# EAGLE design Adafruit 128x64 OLED FeatherWing (EAGLE 9.6.2)
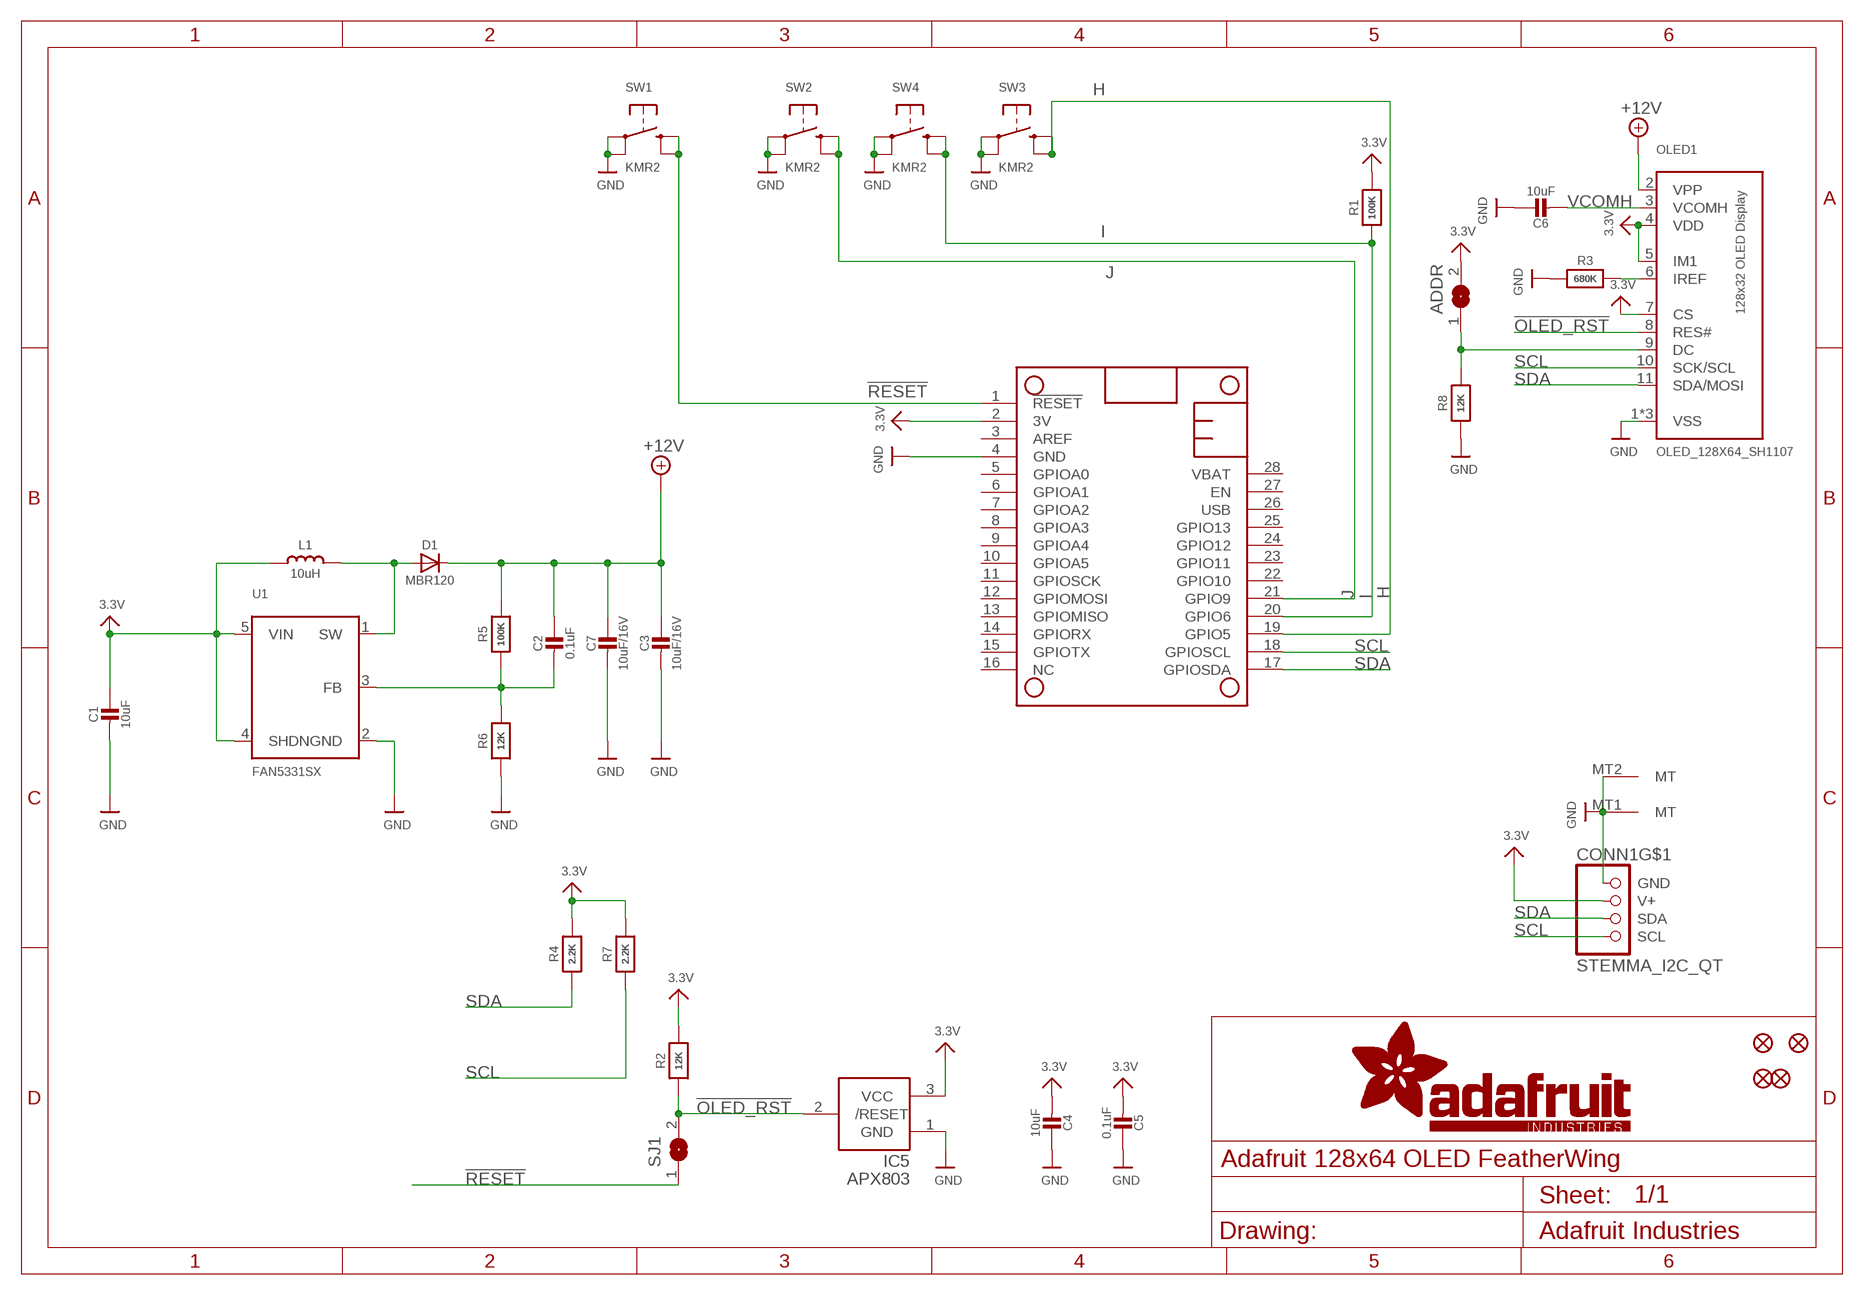
[diagram p0: schematic, sheet 1]

## Parts
ADDR  SOLDERJUMPER  [SOLDERJUMPER_ARROW_NOPASTE]
C1  10uF  CAP_CERAMIC0805-NOOUTLINE  [0805-NO]
C2  0.1uF  CAP_CERAMIC0603_NO  [0603-NO]
C3  10uF/16V  CAP_CERAMIC0805-NOOUTLINE  [0805-NO]
C4  10uF  CAP_CERAMIC0805-NOOUTLINE  [0805-NO]
C5  0.1uF  CAP_CERAMIC0603_NO  [0603-NO]
C6  10uF  CAP_CERAMIC0805-NOOUTLINE  [0805-NO]
C7  10uF/16V  CAP_CERAMIC0805-NOOUTLINE  [0805-NO]
CONN1  STEMMA_I2C_QT  [JST_SH4]
D1  MBR120  DIODESOD-123  [SOD-123]
FID1  FIDUCIAL_1MM  [FIDUCIAL_1MM]
FID2  FIDUCIAL_1MM  [FIDUCIAL_1MM]
FID3  FIDUCIAL_1MM  [FIDUCIAL_1MM]
FID4  FIDUCIAL_1MM  [FIDUCIAL_1MM]
IC5  APX803  AXP083-SAG  [SOT23]
L1  10uH  INDUCTOR  [INDUCTOR_1007]
MS1  FEATHERWING_NODIM  [FEATHERWING_NODIM]
OLED1  OLED_128X64_SH1107  [QT1107P11A]
R1  100K  RESISTOR_0603_NOOUT  [0603-NO]
R2  12K  RESISTOR_0603_NOOUT  [0603-NO]
R3  680K  RESISTOR_0603_NOOUT  [0603-NO]
R4  2.2K  RESISTOR_0603_NOOUT  [0603-NO]
R5  100K  RESISTOR_0603_NOOUT  [0603-NO]
R6  12K  RESISTOR_0603_NOOUT  [0603-NO]
R7  2.2K  RESISTOR_0603_NOOUT  [0603-NO]
R8  12K  RESISTOR_0603_NOOUT  [0603-NO]
SJ1  SOLDERJUMPERCLOSED  [SOLDERJUMPER_CLOSEDWIRE]
SW1  KMR2  SWITCH_TACT_SMT4.6X2.8  [BTN_KMR2_4.6X2.8]
SW2  KMR2  SWITCH_TACT_SMT4.6X2.8  [BTN_KMR2_4.6X2.8]
SW3  KMR2  SWITCH_TACT_SMT4.6X2.8  [BTN_KMR2_4.6X2.8]
SW4  KMR2  SWITCH_TACT_SMT4.6X2.8  [BTN_KMR2_4.6X2.8]
U1  FAN5331SX  VREG_FAN5331  [SOT23-5]

## Nets
3.3V: ADDR.2 C1.1 C4.2 C5.2 CONN1.2(V+) IC5.3(VCC) L1.P$1 MS1.2(3V) OLED1.4(VDD) OLED1.5(IM1) OLED1.7(CS) R1.2 R2.2 R4.2 R7.2 U1.4(SHDN) U1.5(VIN)
!OLED_RST: IC5.2(/RESET) OLED1.8(RES#) R2.1 SJ1.2
!RESET: MS1.1(!RESET) SJ1.1 SW1.B'(S1) SW1.B(S)
+12V: C2.1 C3.1 C7.1 D1.C OLED1.2(VPP) R5.2
GND: C1.2 C3.2 C4.1 C5.1 C6.1 C7.2 CONN1.1(GND) CONN1.MT1(MT) CONN1.MT2(MT) IC5.1(GND) MS1.4(GND) OLED1.1(VSS) OLED1.12(VSS) OLED1.13(VSS) R3.1 R6.1 R8.1 SW1.A'(P1) SW1.A(P) SW2.A'(P1) SW2.A(P) SW3.A'(P1) SW3.A(P) SW4.A'(P1) SW4.A(P) U1.2(GND)
H: MS1.19(GPIO5) SW3.B'(S1) SW3.B(S)
I: MS1.20(GPIO6) R1.1 SW4.B'(S1) SW4.B(S)
J: MS1.21(GPIO9) SW2.B'(S1) SW2.B(S)
N$1: D1.A L1.P$2 U1.1(SW)
N$2: ADDR.1 OLED1.9(DC) R8.2
N$3: C2.2 R5.1 R6.2 U1.3(FB)
N$7: OLED1.6(IREF) R3.2
SCL: CONN1.4(SCL) MS1.18(GPIOSCL) OLED1.10(SCK/SCL) R7.1
SDA: CONN1.3(SDA) MS1.17(GPIOSDA) OLED1.11(SDA/MOSI) R4.1
VCOMH: C6.2 OLED1.3(VCOMH)
Unconnected: MS1.3(AREF) MS1.5(GPIOA0) MS1.6(GPIOA1) MS1.7(GPIOA2) MS1.8(GPIOA3) MS1.9(GPIOA4) MS1.10(GPIOA5) MS1.11(GPIOSCK) MS1.12(GPIOMOSI) MS1.13(GPIOMISO) MS1.14(GPIORX) MS1.15(GPIOTX) MS1.16(NC) MS1.22(GPIO10) MS1.23(GPIO11) MS1.24(GPIO12) MS1.25(GPIO13) MS1.26(USB) MS1.27(EN) MS1.28(VBAT)

## Library data of the parts
ADDR = microbuilder:SOLDERJUMPER: SMD Solder JUMPER Solder the two pads together to create a connection, or remove the solder to break it. REFLOW - Use this footprint for solder paste and reflow ovens. WAVE - Use this footprint for hand-soldering (larger pads). CLOSED - Has a trace between the two pads to ensure it is closed by default. The trace needs to be cut to disable the jumper, and can be closed again by creating a solder bridge between the two pads.; BOM: EXCLUDE
C1-C7 = microbuilder:CAP_CERAMIC: Ceramic Capacitors For new designs, use the packages preceded by an '_' character since they are more reliable: The following footprints should be used on most boards: _0402 - Standard footprint for regular board layouts _0603 - Standard footprint for regular board layouts _0805 - Standard footprint for regular board layouts _1206 - Standard footprint for regular board layouts For extremely tight-pitch boards where space is at a premium, the following 'micro-pitch' footprints can be used (smaller pads, no silkscreen outline, etc.): _0402MP - Micro-pitch footprint for very dense/compact boards _0603MP - Micro-pitch footprint for very dense/compact boards _0805MP - Micro-pitch footprint for very dense/compact boards _1206MP - Micro-pitch footprint for very dense/compact boards
CONN1 = microbuilder:STEMMA_I2C
D1 = microbuilder:DIODE: Diode SMA Model Volts Amps Type Vf Ir Digikey # Notes SSA34-E3 40V 3A Schottky 480mV @ 3A 200uA @ 40V SSA34-E3/61TGITR-ND CDBA120-G 20V 1A Schottky 500mV @ 1A 500uA @ 20V 641-1014-6-ND REEL MBRA210 10V 2A Schottky 350mV @ 2A 700uA @ 10V MBRA210LT3 SOD-123 Model Volts Amps Type Vf Ir Order # Notes BAT54T1G 30V 200mA Schottky 800mV @ 200mA 2uA @ 25V BAT54T1GOSTR-ND B0530W 30V 500mA Schottky 430mV @ 500mA 130uA @ 30V B0530W-FDICT-ND REEL MBR120 20V 1A Schottky 340mV @ 1A MBR120VLSFT1GOSCT-ND SOD-323 Model Volts Amps Type Vf Ir Order # Notes PMEG2005EJ 20V 500mA Schottky 355mV @ 500mA 568-4110-1-ND ZLLS410 10V 570mA Schottky 380mV @ 570mA ZLLS410CT-ND 1N4148WS 75V 150mA Silicon/Simple 1V 1N4148WSFSCT-ND REEL SOD-523 Model Volts Amps Type Vf Ir Order # Notes BAT54XV2 30V 200mA Schottky 0.8V @ 100mA BAT54XV2CT-ND TB751S 30V 30mA Schottky RB751S-40TE61CT-ND SOT23-R/W (R = Solder Paste/Reflow Ovens, W = Hand-Soldering) Model Volts Amps Type Vf Ir Order # Notes BAT54FILM 40V 300mA Schottky 497-7162-1-ND POWERDI-5 Model Volts Amps Type Vf Ir Order # Notes PDS560 60V 5A Schottky 670mV @ 5A 150uA @ 60V PDS560DICT-ND
FID1-FID4 = microbuilder:FIDUCIAL: Fiducial Alignment Points Various fiducial points for machine vision alignment.; BOM: EXCLUDE
IC5 = adafruit:AXP083
L1 = microbuilder:INDUCTOR: Inductors 0603: 10nH Ceramic Inductor - microwire antenna/RF (Digikey: 712-1434-2-ND) 0805: 560nH Ceramic Inductor - RF (Digikey: 553-1047-1-ND) 270nH Ceramic Inductor - Q = 40@250MHz, +-5%, 1 Ohm DC Resistance (Digikey: 535-10506-2-ND) 1007 (2518 Metric) SMT: 10µH 10% 250mOhm 820mA 1007 Inductor (Digikey: 587-2189-1-ND) 22µH 10% 500mOhm 580mA 1007 Inductor (Digikey: 587-2190-1-ND) 47µH 10% 950mOhm 420mA 1007 Inductor (Digikey: 587-2191-1-ND) 47µH 5% 100mOhm 1A 1008 Inductor (Digikey: 732-1816-1-ND) 5.0x5.0mm (Taiyo Yuden NR5040 Series) 6.8µH 20% 2.3A 64mOhm Inductor (Digikey: 587-2374-2-ND) 5.0x5.0mm (TDK VLC5045 Series) 4.7µH 20% 3.3A 34mOhm Inductor (Digikey: 445-6526-1-ND) 6.8µH 20% 2.7A 46mOhm Inductor (Digikey: 445-6527-1-ND) 6.0x6.0mm (TDK VLC6045 Series) 4.7µH 20% 3.8A 27mOhm Inductor (Digikey: 445-6538-2-ND) 6.8µH 20% 3A 41mOhm Inductor (Digikey: 445-6540-1-ND) 6.2µH 30% 2.2A 45mOhm Inductor (Digikey: SRR5028-6R2YCT-ND) - Not TDK VLC6045 but footprint should match 6.0x6.0mm (TDK SLF6045 Series) 6.8uH 30% 2A 33mOhm Inductor (Digikey: 445-4572-1-ND, Mouser: 810-SLF645T6R8N2R0PF) 6.0x6.0mm (Sumida CDRH5D28 Series) 6.2uH 30% 1.8A 45mOhm Inductor (Digikey: 308-1542-1-ND) Taiyo Yuden NR3015T2R2M - 2.2uH 20% 1.5A (Digikey: 587-1648-2-ND, Mouser: 963-NR3015T2R2M) - Used with TI TPS62172 CoilCraft RFID Transponder Coil - MA5532-AE (For use with AS3935 Lightning Sensor) Taiyo Yuden NRH2412T2R2MNGH - 2.2uH 20% 1AA (Digikey: 587-3443-1-ND) - Used with TI LM3671 Vishay IHLP 1.0uH Molded Inductor - 24mOhm DCR, 5A, +/-20%, -55°C-125°C (Digikey: 541-1319-1-ND)
MS1 = microbuilder:FEATHERWING
OLED1 = adafruit_display:OLED_128X64_SH1107
R1-R8 = microbuilder:RESISTOR: Resistors For new designs, use the packages preceded by an '_' character since they are more reliable: The following footprints should be used on most boards: _0402 - Standard footprint for regular board layouts _0603 - Standard footprint for regular board layouts _0805 - Standard footprint for regular board layouts _1206 - Standard footprint for regular board layouts For extremely tight-pitch boards where space is at a premium, the following 'micro-pitch' footprints can be used (smaller pads, no silkscreen outline, etc.): _0402MP - Micro-pitch footprint for very dense/compact boards _0603MP - Micro-pitch footprint for very dense/compact boards _0805MP - Micro-pitch footprint for very dense/compact boards _1206MP - Micro-pitch footprint for very dense/compact boards
SJ1 = microbuilder:SOLDERJUMPER: SMD Solder JUMPER Solder the two pads together to create a connection, or remove the solder to break it. REFLOW - Use this footprint for solder paste and reflow ovens. WAVE - Use this footprint for hand-soldering (larger pads). CLOSED - Has a trace between the two pads to ensure it is closed by default. The trace needs to be cut to disable the jumper, and can be closed again by creating a solder bridge between the two pads.
SW1-SW4 = microbuilder:SWITCH_TACT_SMT: SMT Tact Switches 6x6mm - Digikey: P12940SCT-ND KMR2 (4.6x2.8mm) - Digikey: 401-1426-1-ND EVQ-PQHB55 - Light Touch, 160GF (4.5x4.5mm) - Digikey: P8090SCT-ND KMT0 - KMT021 NGJ LHS (etc.) IP68/Waterproof - Digikey: CKN10289CT-ND
U1 = microbuilder:VREG_FAN5331: FAN5331 - LED/OLED 20V Boost Converter Digikey: FAN5331SXCT-ND

## Board
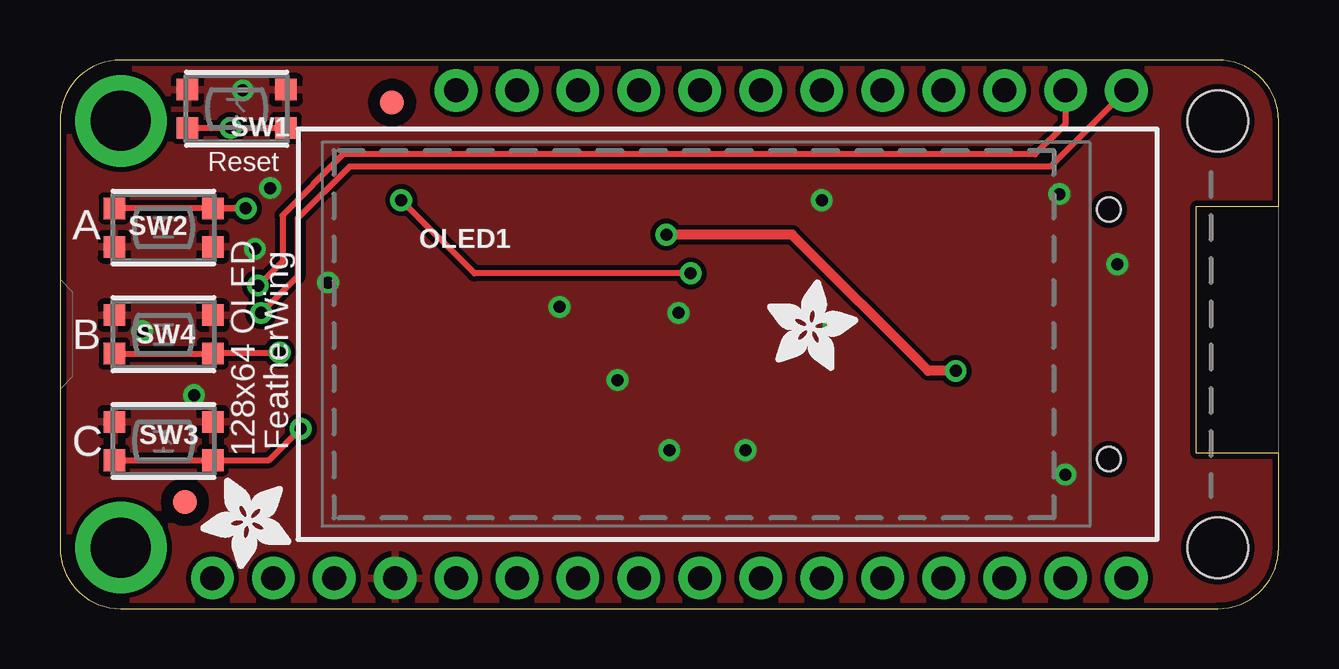
[diagram p1: board, top side]
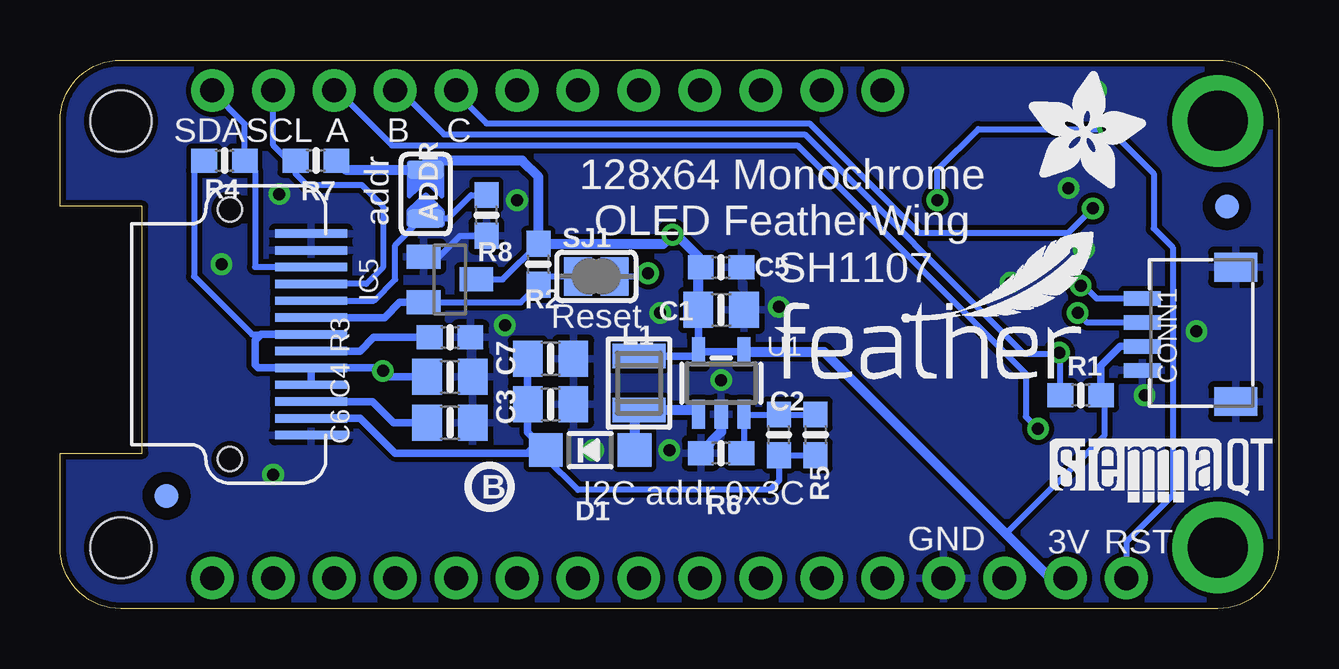
[diagram p2: board, bottom side, seen from below]

Size 50.8 x 22.86 mm. Coordinates in mm from the lower left corner, seen from the top.
Outline: 50.8,16.76 50.8,20.32 arc90 48.26,22.86 2.54,22.86 arc90 0,20.32 0,2.54 arc90 2.54,0 48.26,0 arc90 50.8,2.54 50.8,6.48 47.37,6.48 47.37,16.76 50.8,16.76
Copper layers (1*16): Top 0.035mm / dielectric 1.5mm / Bottom 0.035mm
Design rules "adafruit": minimum track width 8mil, minimum drill 15.5mil, track to track 8mil, track to pad 8mil, pad to pad 8mil, via to via 8mil, smd to smd 8mil, copper to edge 10mil, drill to drill 8mil, minimum pad ring 10mil, minimum via ring 8mil, stop-mask expansion 2mil, vias tented up to drill 20mil, thermal gap 10mil

### Footprints (pad centres in the part's own frame; a part is rotated, then mirrored left to right if it is on the bottom)
SOLDERJUMPER_ARROW_NOPASTE = smd 0.762 x 1.524: 1 -1.016,0; 2 1.016,0
0805-NO = smd 1.24 x 1.5: 1 -0.95,0; 2 0.95,0
0603-NO = smd 1.075 x 1: 1 -0.85,0; 2 0.85,0
JST_SH4 = smd 0.6 x 1.55: 1 -1.5,2.514; 2 -0.5,2.514; 3 0.5,2.514; 4 1.5,2.514 | smd 1.2 x 1.8: MT1 -2.8,-1.386; MT2 2.8,-1.386
SOD-123 = smd 1.4 x 1.4: A 1.85,0; C -1.85,0
FIDUCIAL_1MM = smd 1 x 1: 1 0,0
SOT23 = smd 1 x 1.4: 1 -0.95,-1.1; 2 0.95,-1.1; 3 0,1.1
INDUCTOR_1007 = smd 1.016 x 2.2: P$1 -1.127,0; P$2 1.127,0
FEATHERWING_NODIM = drill 1 pad 1.778: 1 6.35,1.27; 2 8.89,1.27; 3 11.43,1.27; 4 13.97,1.27; 5 16.51,1.27; 6 19.05,1.27; 7 21.59,1.27; 8 24.13,1.27; 9 26.67,1.27; 10 29.21,1.27; 11 31.75,1.27; 12 34.29,1.27; 13 36.83,1.27; 14 39.37,1.27; 15 41.91,1.27; 16 44.45,1.27; 17 44.45,21.59; 18 41.91,21.59; 19 39.37,21.59; 20 36.83,21.59; 21 34.29,21.59; 22 31.75,21.59; 23 29.21,21.59; 24 26.67,21.59; 25 24.13,21.59; 26 21.59,21.59; 27 19.05,21.59; 28 16.51,21.59 | drill 2.5 pad 3.81: P$1 2.54,20.32; P$2 2.54,2.54 | hole 2.54: 48.26,20.32; 48.26,2.54
QT1107P11A = smd 3 x 0.35 bottom: 1 -5.38,-4.2; 2 -5.38,-3.5; 3 -5.38,-2.8; 4 -5.38,-2.1; 5 -5.38,-1.4; 6 -5.38,-0.7; 7 -5.38,0; 8 -5.38,0.7; 9 -5.38,1.4; 10 -5.38,2.1; 11 -5.38,2.8; 12 -5.38,3.5; 13 -5.38,4.2 | hole 1: -2,5.2; -2,-5.2
SOLDERJUMPER_CLOSEDWIRE = smd 1.168 x 1.6: 1 -0.762,0; 2 0.762,0 | smd 0.635 x 0.203: WIRE 0,0
BTN_KMR2_4.6X2.8 = smd 0.9 x 0.9: A 2.05,0.8; A' -2.05,0.8; B 2.05,-0.8; B' -2.05,-0.8
SOT23-5 = smd 0.55 x 1.2: 1 -0.95,-1.3; 2 0,-1.3; 3 0.95,-1.3; 4 0.95,1.3; 5 -0.95,1.3

### Placement (x,y rotation side)
ADDR  35.56,17.27 90 bottom
C1  23.24,12.45 0 bottom
C2  20.83,7.24 90 bottom
C3  30.35,8.51 0 bottom
C4  34.54,9.65 180 bottom
C5  23.24,14.22 180 bottom
C6  34.54,7.75 180 bottom
C7  30.35,10.41 0 bottom
CONN1  3.17,11.43 90 bottom
D1  28.7,6.6 0 bottom
FID1  46.35,4.7 0 bottom
FID2  5.21,4.45 0 top
FID3  13.84,21.08 0 top
FID4  2.16,16.76 0 bottom
IC5  34.54,13.72 270 bottom
L1  26.67,9.4 270 bottom
MS1  0,0 0 top
OLED1  45.72,11.43 0 top
R1  8.26,8.89 0 bottom
R2  30.86,14.35 90 bottom
R3  34.54,11.3 180 bottom
R4  43.94,18.67 180 bottom
R5  19.3,7.24 270 bottom
R6  23.24,6.48 0 bottom
R7  40.13,18.67 0 bottom
R8  33.02,16.38 90 bottom
SJ1  28.45,13.84 180 bottom
SW1  7.37,20.83 0 top
SW2  4.32,15.88 180 top
SW3  4.32,6.99 0 top
SW4  4.32,11.43 0 top
U1  23.24,9.4 0 bottom
U$8  [ADAFRUIT_5MM]  10.41,17.53 0 bottom
U$14  [PCBFEAT-REV-040]  32.89,5.08 0 bottom
U$16  [ADAFRUIT_3.5MM]  29.46,9.91 0 top
U$35  [STEMMAQT]  9.53,4.45 0 bottom
U$36  [FEATHERLOGO_SMALL]  21.08,9.53 0 bottom
U$37  [ADAFRUIT_3.5MM]  9.65,5.46 180 top

### Tracks (layer width: path | path; a pad name or v marks a point on that pad's centre or on a via)
3.3V  (via drill 0.5)
  Top 0.406: v37.34,9.91 36.2,9.91 30.52,15.58 v25.27,15.58
  Bottom 0.254: IC5.3 32.35,13.72 R2.2 | R1.2 7.28,8.76 7.28,7.2 11.37,3.11 | R4.2 45.21,18.25 45.21,13.84 42.8,11.43 42.16,11.43
  Bottom 0.305: OLED1.4 OLED1.5 | OLED1.5 42.54,10.03 42.67,10.16 42.67,11.18 42.42,11.43 42.16,11.43 OLED1.7 | OLED1.5 37.46,10.03 v37.34,9.91 37.08,9.65 C4.2 | CONN1.2 6.6,10.93 7.41,10.13 R1.2 | U1.4 U1.5 | C1.1 U1.5 | U1.5 24.36,10.53 L1.P$1
  Bottom 0.406: C1.1 24.19,14.12 | 24.19,14.12 24.19,14.67 25.11,15.58 v25.27,15.58 25.65,15.2 R2.2 30.86,18 31.54,18.67 35.43,18.67 35.81,18.29 | U1.4 18.95,10.7 11.37,3.11 9.53,1.27 MS1.2 | R7.2 38.9,18.29 35.81,18.29 | 35.81,18.29 ADDR.2 | C5.2 24.19,14.12
!OLED_RST
  Bottom 0.254: IC5.2 31.6,12.77 R2.1 30.52,13.84 SJ1.2
  Bottom 0.305: OLED1.8 37.27,12.13 36.64,12.77 IC5.2
!RESET  (via drill 0.5)
  Top 0.254: SW1.B v7.11,20.03 SW1.B' | v26.29,13.97 17.27,13.97 v14.22,17.02
  Bottom 0.254: SJ1.1 26.42,13.84 v26.29,13.97 | v7.11,20.03 7.07,19.98 | 7.07,19.98 5.21,18.12 5.21,15.84 4.42,15.06 4.42,4.72 6.35,2.79 MS1.1 | v14.22,17.02 14.22,18.29 12.53,19.98 7.07,19.98
+12V
  Bottom 0.254: R5.2 C2.1 20.83,5.33 21.21,4.95 29.21,4.95 30.55,6.29 D1.C
  Bottom 0.305: C7.1 C3.1 31.3,7.36 D1.C 30.99,6.6 31.08,6.7 31.3,6.48 36.83,6.48 38.28,7.93 OLED1.2
GND  (via drill 0.5)
  Bottom 0.254: IC5.1 34.99,14.67 34.12,15.53 R8.1
  Bottom 0.406: U1.2 23.24,7.37 24.09,6.52 R6.1
  other vias: 20.83,12.57 7.62,21.59 3.43,11.56 41.91,5.59 5.59,8.89 41.66,17.27 44.07,14.35 8.76,17.53 8.13,14.99 11.18,13.59 31.75,17.02 28.57,6.6 25.4,6.6 25.78,12.32 32.26,11.81 23.24,9.53
  pour Bottom: 0,22.86 0,0 50.8,0 50.8,22.86
  pour Top: 0,22.86 0,0 50.8,0 50.8,22.86
H  (via drill 0.5)
  Top 0.254: v10.03,7.49 8.72,6.18 SW3.B SW3.B'
  Bottom 0.254: v10.03,7.49 10.54,8 10.54,9.78 20.07,19.3 36.96,19.3 39.24,21.59 MS1.19
I  (via drill 0.5)
  Top 0.254: SW4.B' SW4.B 6.41,10.67 v9.15,10.67
  Bottom 0.254: MS1.20 36.63,21.59 34.8,19.76 19.75,19.76 10.62,10.63 9.19,10.63 | 9.19,10.63 v9.15,10.67 | R1.1 9.11,10.54 9.19,10.63
J  (via drill 0.5)
  Top 0.254: SW2.B' v7.75,16.68 SW2.B
  Bottom 0.254: MS1.21 34.29,21.49 33.02,20.22 19.56,20.22 15,15.66 8.76,15.66 v7.75,16.68
N$1
  Bottom 0.406: U1.1 24.36,8.27 L1.P$2 26.85,8.09 D1.A
N$2
  Bottom 0.254: OLED1.9 37.72,12.83 36.83,13.72 36.83,15.15 35.72,16.26 ADDR.1 34.63,16.26 33.66,17.23 R8.2
N$3
  Bottom 0.254: R5.1 C2.2 U1.3 22.29,6.58 R6.2
N$7
  Bottom 0.305: R3.2 37.72,11.3 38.29,10.73 OLED1.6
SCL  (via drill 0.5)
  Top 0.254: MS1.18 41.91,20.19 40.64,18.92 11.81,18.92 9.27,16.38 9.27,14.48 v8.26,13.46
  Bottom 0.254: MS1.18 41.91,19.3 41.27,18.67 R7.1 40.98,18.12 40.51,17.65 38.23,17.65 37.34,16.76 37.34,14.22 38.03,13.53 OLED1.10 | v8.26,13.46 8.13,13.46 7.6,12.93 CONN1.4
SDA  (via drill 0.5)
  Top 0.254: MS1.17 41.27,18.41 12.06,18.41 9.91,16.26 9.91,13.84 v8.38,12.32
  Bottom 0.254: MS1.17 44.45,21.55 43.09,20.19 R4.1 42.67,18.25 42.67,14.23 OLED1.11 | v8.38,12.32 7.99,11.93 CONN1.3
VCOMH
  Bottom 0.305: C6.2 36.89,7.75 37.77,8.63 OLED1.3

### Text on the board
tPlace: Reset | A | B | FeatherWing | C | 128x64 OLED
bPlace: C | B | A | SCL | SDA | 128x64 Monochrome / OLED FeatherWing | addr | SH1107 | Reset | I2C addr 0x3C | RST | 3V | GND